# EAGLE design Combine-CPU-POWER-RELAY-smd (EAGLE 7.6.0)
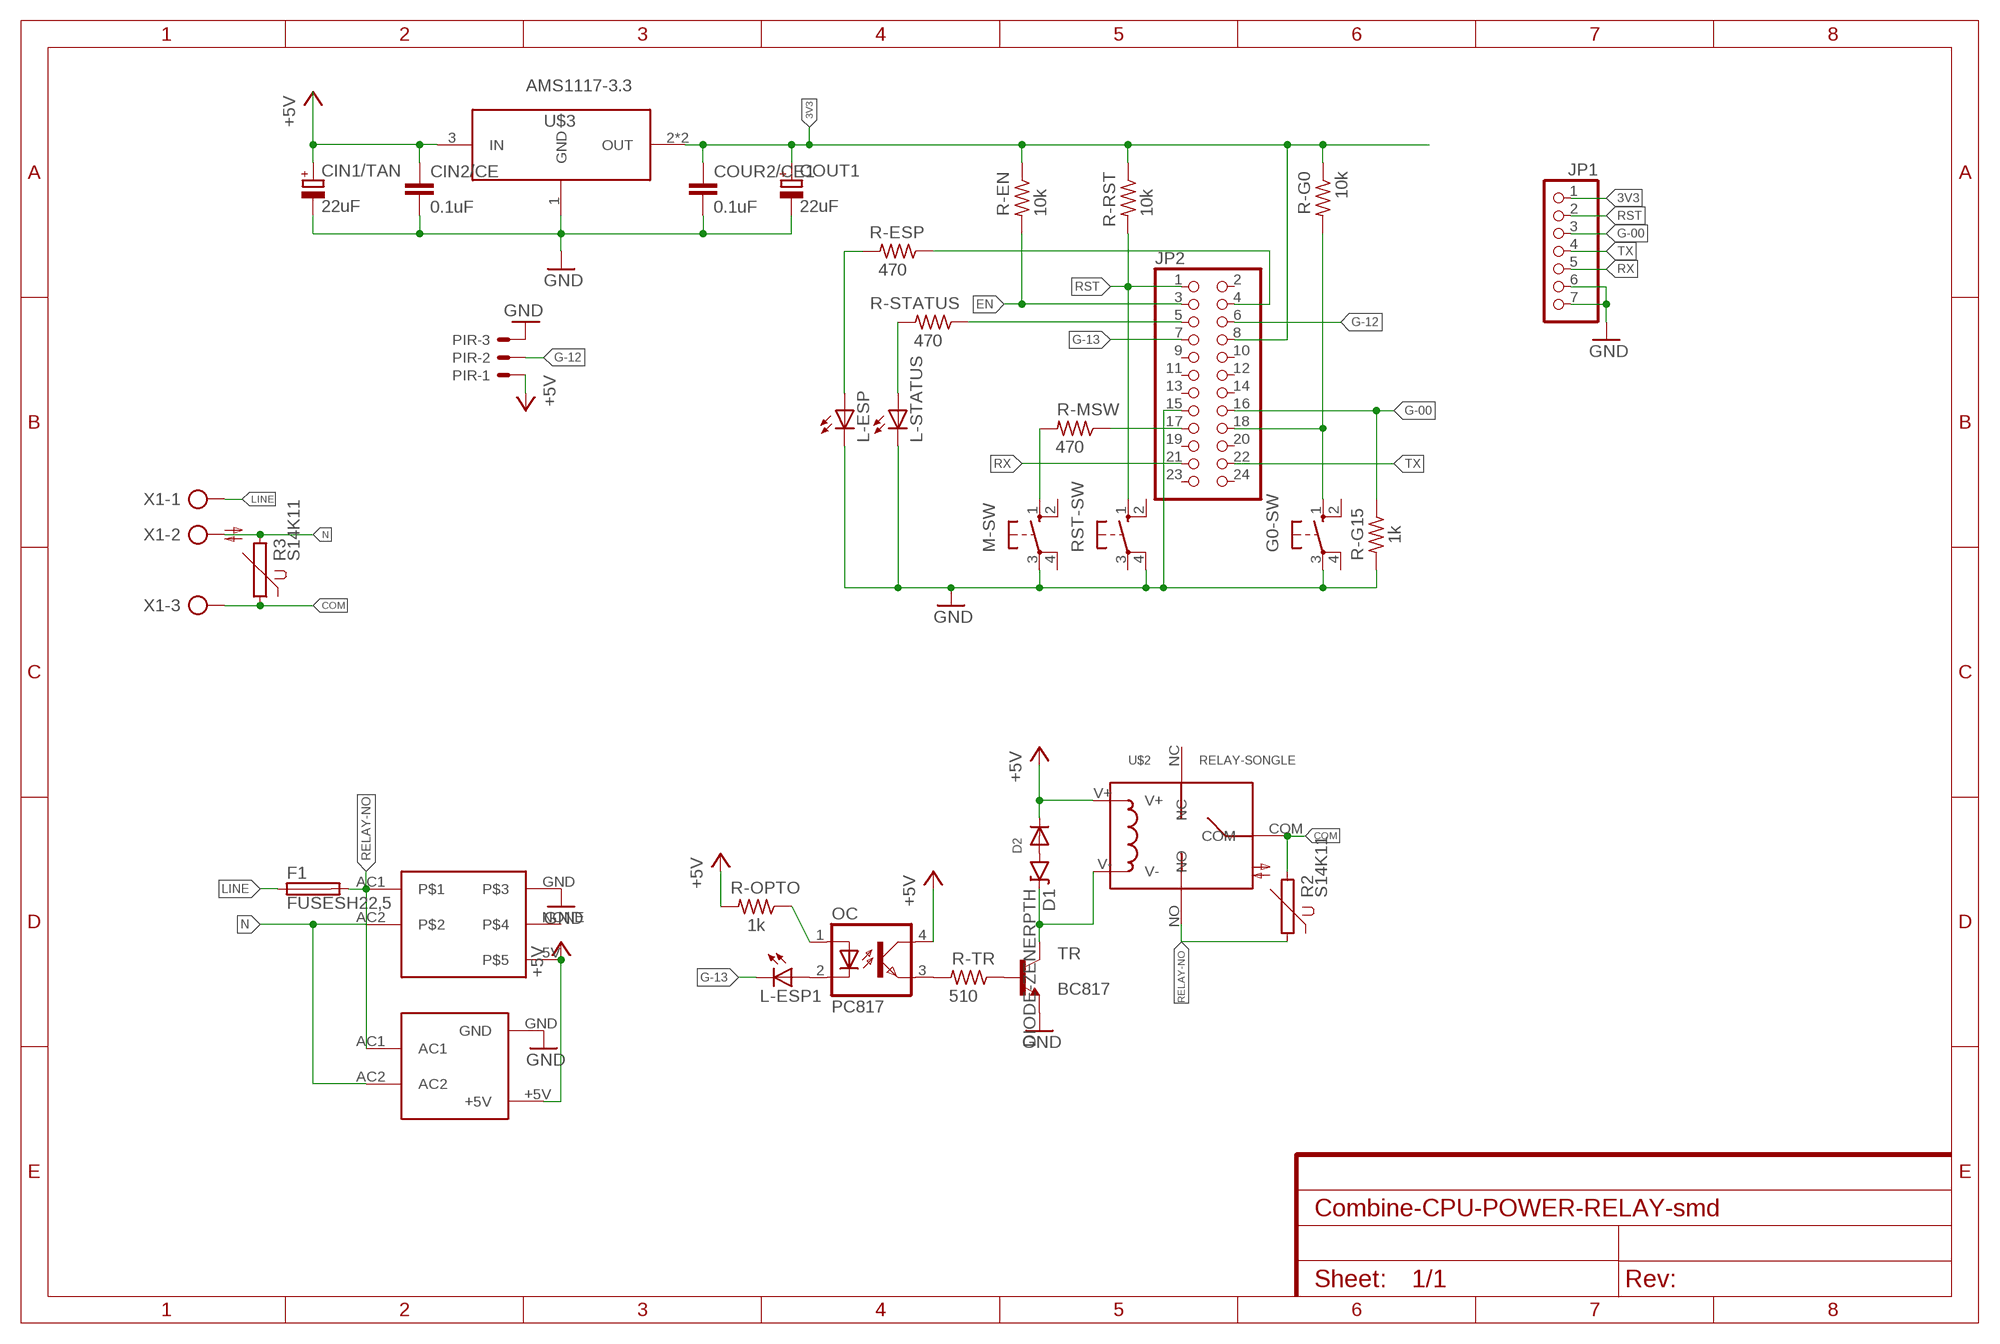
[diagram p0: schematic, sheet 1]

## Parts
CIN1/TAN  22uF  CPOL-EUB/3528-21R  [B/3528-21R]
CIN2/CE  0.1uF  C-EUC0805  [C0805]
COUR2/CE1  0.1uF  C-EUC0805  [C0805]
COUT1  22uF  CPOL-EUB/3528-21R  [B/3528-21R]
D1  DIODE-ZENERPTH  [DIODE-ZENER]
D2  DIODESMA  [SMADIODE]
F1  FUSESH22,5  [SH22,5]
G0-SW  10-XX  [B3F-10XX]
JP1  PINHD-1X7  [1X07]
JP2  PINHD-2X12  [2X12]
L-ESP  LED3MM  [LED3MM]
L-ESP1  LED3MM  [LED3MM]
L-STATUS  LED3MM  [LED3MM]
M-SW  10-XX  [B3F-10XX]
OC  PC817  [DIL04]
PIR  53048-03  [53048-03]
R2  S14K11  [S14K11]
R3  S14K11  [S14K11]
R-EN  10k  R-US_M0805  [M0805]
R-ESP  470  R-US_M0805  [M0805]
R-G0  10k  R-US_M0805  [M0805]
R-G15  1k  R-US_M0805  [M0805]
R-MSW  470  R-US_M0805  [M0805]
R-OPTO  1k  R-US_M0805  [M0805]
R-RST  10k  R-US_M0805  [M0805]
R-STATUS  470  R-US_M0805  [M0805]
R-TR  510  R-US_M0805  [M0805]
RST-SW  10-XX  [B3F-10XX]
TR  BC817  BC817-16SMD  [SOT23-BEC]
U$1  HLK-PM01  [HLK-PM01]
U$2  RELAY-SONGLE  [RELAY-SONGLE]
U$3  AMS1117-3.3  [SOT-223]
U$4  POWERSUPPLY-5V-700MA  [POWERSUPPLY-5V-700MA]
X1  AK300/3  [AK300/3]

## Nets
3V3: COUR2/CE1.1 COUT1.+ JP1.1 JP2.8 R-EN.1 R-G0.1 R-RST.1 U$3.2(OUT) U$3.4(OUT)
+5V: CIN1/TAN.+ CIN2/CE.1 D2.C OC.4(COL) PIR.1 R-OPTO.2 U$1.+5V U$2.V+ U$3.3(IN) U$4.5V
COM: R2.2 R3.1 U$2.COM X1.3
EN: JP2.3 R-EN.2
G-00: JP1.3 JP2.16 R-G15.1
G-12: JP2.6 PIR.2
G-13: JP2.7 L-ESP1.K(C)
GND: CIN1/TAN.- CIN2/CE.2 COUR2/CE1.2 COUT1.- G0-SW.3(P) JP1.6 JP1.7 JP2.15 L-ESP.K(C) L-STATUS.K(C) M-SW.3(P) PIR.3 R-G15.2 RST-SW.4(P1) TR.E U$1.GND U$3.1(GND) U$4.GND
LINE: F1.1 X1.1
N: R3.2 U$1.AC2 U$4.AC2 X1.2
N$1: OC.3(EMIT) R-TR.2
N$2: R-TR.1 TR.B
N$7: JP2.17 R-MSW.1
N$8: JP2.5 R-STATUS.1
N$13: OC.1(A) R-OPTO.1
N$16: D1.P$2(A) D2.A
N$17: D1.P$1(C) TR.C U$2.V-
N$19: JP2.4 R-ESP.1
N$23: L-ESP1.A OC.2(C)
N$24: M-SW.1(S) R-MSW.2
N$25: L-STATUS.A R-STATUS.2
N$26: L-ESP.A R-ESP.2
N$27: G0-SW.1(S) JP2.18 R-G0.2
RELAY-NO: F1.2 R2.1 U$1.AC1 U$2.NO U$4.AC1
RST: JP1.2 JP2.1 R-RST.2 RST-SW.1(S)
RX: JP1.5 JP2.21
TX: JP1.4 JP2.22
Unconnected: G0-SW.2(S1) G0-SW.4(P1) JP2.2 JP2.9 JP2.10 JP2.11 JP2.12 JP2.13 JP2.14 JP2.19 JP2.20 JP2.23 JP2.24 M-SW.2(S1) M-SW.4(P1) RST-SW.2(S1) RST-SW.3(P) U$2.NC U$4.NONE

## Library data of the parts
CIN1/TAN COUT1 = rcl:CPOL-EU: POLARIZED CAPACITOR, European symbol
CIN2/CE COUR2/CE1 = rcl:C-EU: CAPACITOR, European symbol
D1 = SparkFun-DiscreteSemi:DIODE-ZENER: Zener Diode Production Part - 8199 3.4V Zener Voltage
D2 = adafruit:DIODE: Diode SMADIODE - SMA Surface Mount Package 20V 1A Schottky Diode Digikey: 641-1014-6-ND DO-1N4148 - Through Hole Small Current Diode SOD-123 20V 1 A (.5mV Vf) Schottky Diode - Digikey: MBRX120TPMSCT-ND SOD-323 10V 570mA (.38mV Vf, 3ns) Schottky Diode - Digikey: ZLLS410CT-ND SOD-523 30V 30mA Schottky Diode (RB751S-40TE61) - Digikey: RB751S-40TE61CT-ND SOT23-R/W - SOT23 Package (R = Solder Paste/Reflow Ovens, W = Hand-Soldering) BAT54Film 40V 300mA - Digikey: 497-7162-1-ND
F1 = fuse:FUSE: Fuse; OC_FARNELL: unknown; OC_NEWARK: unknown
G0-SW M-SW RST-SW = switch-omron:10-XX: OMRON SWITCH; MPN: B3F-1000; OC_FARNELL: 176432; OC_NEWARK: 36M3542
JP1 = pinhead:PINHD-1X7: PIN HEADER
JP2 = pinhead:PINHD-2X12: PIN HEADER
L-ESP L-ESP1 L-STATUS = led:LED: LED OSRAM: - CHIPLED LG R971, LG N971, LY N971, LG Q971, LY Q971, LO R971, LY R971 LH N974, LH R974 LS Q976, LO Q976, LY Q976 LO Q996 - Hyper CHIPLED LW Q18S LB Q993, LB Q99A, LB R99A - SideLED LS A670, LO A670, LY A670, LG A670, LP A670 LB A673, LV A673, LT A673, LW A673 LH A674 LY A675 LS A676, LA A676, LO A676, LY A676, LW A676 LS A679, LY A679, LG A679 - Hyper Micro SIDELED® LS Y876, LA Y876, LO Y876, LY Y876 LT Y87S - SmartLED LW L88C, LW L88S LB L89C, LB L89S, LG L890 LS L89K, LO L89K, LY L89K LS L896, LA L896, LO L896, LY L896 - TOPLED LS T670, LO T670, LY T670, LG T670, LP T670 LSG T670, LSP T670, LSY T670, LOP T670, LYG T670 LG T671, LOG T671, LSG T671 LB T673, LV T673, LT T673, LW T673 LH T674 LS T676, LA T676, LO T676, LY T676, LB T676, LH T676, LSB T676, LW T676 LB T67C, LV T67C, LT T67C, LS T67K, LO T67K, LY T67K, LW E67C LS E67B, LA E67B, LO E67B, LY E67B, LB E67C, LV E67C, LT E67C LW T67C LS T679, LY T679, LG T679 LS T770, LO T770, LY T770, LG T770, LP T770 LB T773, LV T773, LT T773, LW T773 LH T774 LS E675, LA E675, LY E675, LS T675 LS T776, LA T776, LO T776, LY T776, LB T776 LHGB T686 LT T68C, LB T68C - Hyper Mini TOPLED® LB M676 - Mini TOPLED Santana® LG M470 LS M47K, LO M47K, LY M47K Source: http://www.osram.convergy.de LUXEON: - LUMILED® LXK2-PW12-R00, LXK2-PW12-S00, LXK2-PW14-U00, LXK2-PW14-V00 LXK2-PM12-R00, LXK2-PM12-S00, LXK2-PM14-U00 LXK2-PE12-Q00, LXK2-PE12-R00, LXK2-PE12-S00, LXK2-PE14-T00, LXK2-PE14-U00 LXK2-PB12-K00, LXK2-PB12-L00, LXK2-PB12-M00, LXK2-PB14-N00, LXK2-PB14-P00, LXK2-PB14-Q00 LXK2-PR12-L00, LXK2-PR12-M00, LXK2-PR14-Q00, LXK2-PR14-R00 LXK2-PD12-Q00, LXK2-PD12-R00, LXK2-PD12-S00 LXK2-PH12-R00, LXK2-PH12-S00 LXK2-PL12-P00, LXK2-PL12-Q00, LXK2-PL12-R00 Source: www.luxeon.com KINGBRIGHT: KA-3528ASYC Source: www.kingbright.com
OC = optocoupler:PC817: SHARP OPTO COUPLER; MPN: PC817X4J000F; OC_FARNELL: 9707727; OC_NEWARK: 97K7059
PIR = con-molex:53?-03: CONNECTOR wire to board 1.25 mm (.049 inch) pitch header; MF: WALDOM/MOLEX; MPN: 53048-0310; OC_FARNELL: 9732918; OC_NEWARK: 38C9908
R2 R3 = varistor:S14K11: VARISTOR
R-EN R-ESP R-G0 R-G15 R-MSW R-OPTO R-RST R-STATUS R-TR = rcl:R-US_: RESISTOR, American symbol
TR = transistor-npn:BC817*: NPN Transistor
U$1 = HLK-PM01:HLK-PM01
U$2 = Seeed-OPL-Relay:RELAY-SONGLE
U$3 = AMS1117-3.3:AMS1117-3.3: 1A LOW DROPOUT VOLTAGE REGULATOR
U$4 = PowerSupply-5V-700mA:POWERSUPPLY-5V-700MA
X1 = con-ptr500:AK300/3: CONNECTOR; OC_FARNELL: unknown; OC_NEWARK: unknown

## Net classes
0 default: width 0.305 mm

## Board
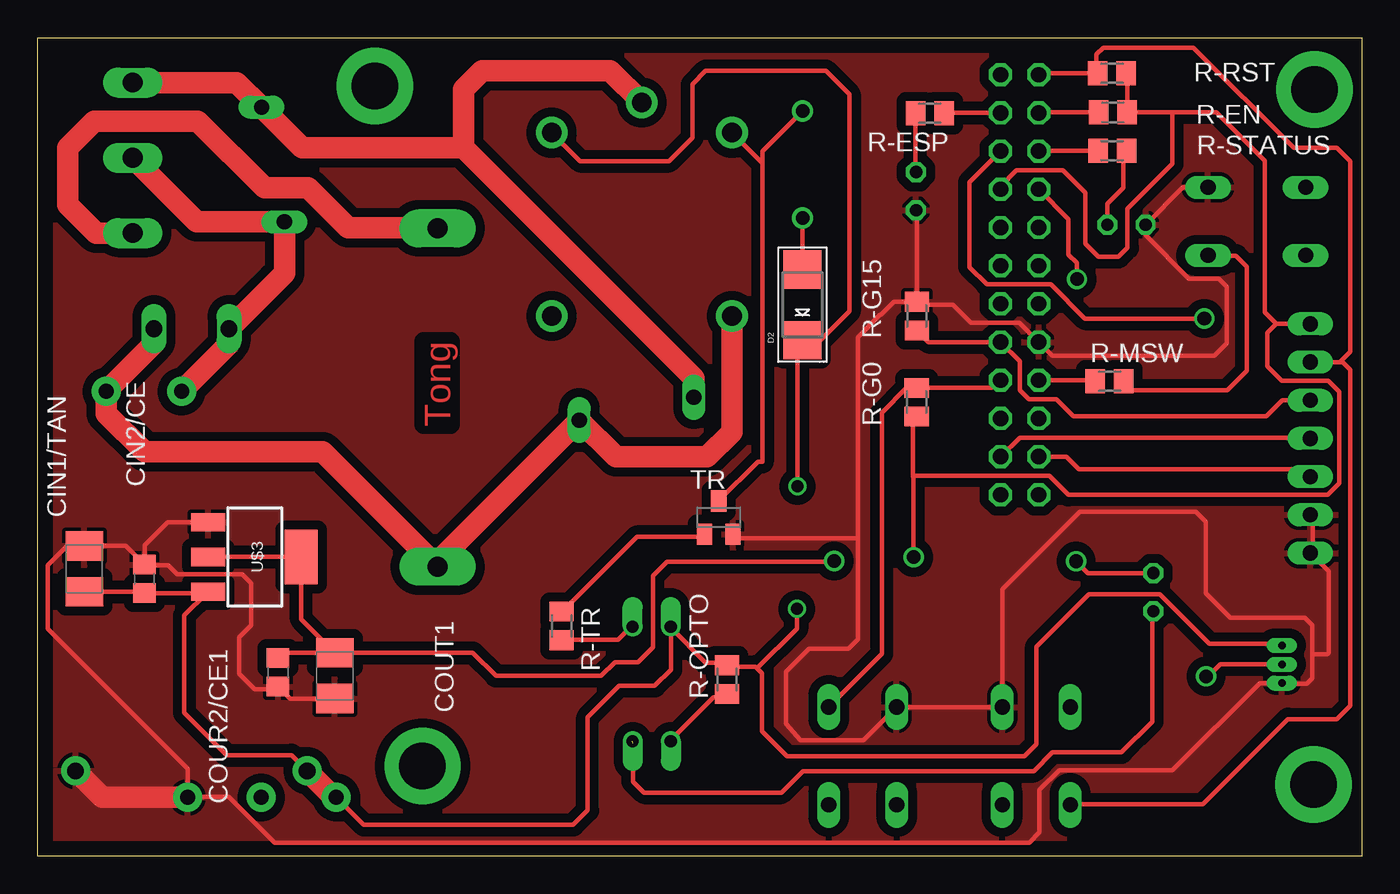
[diagram p1: board, top side]
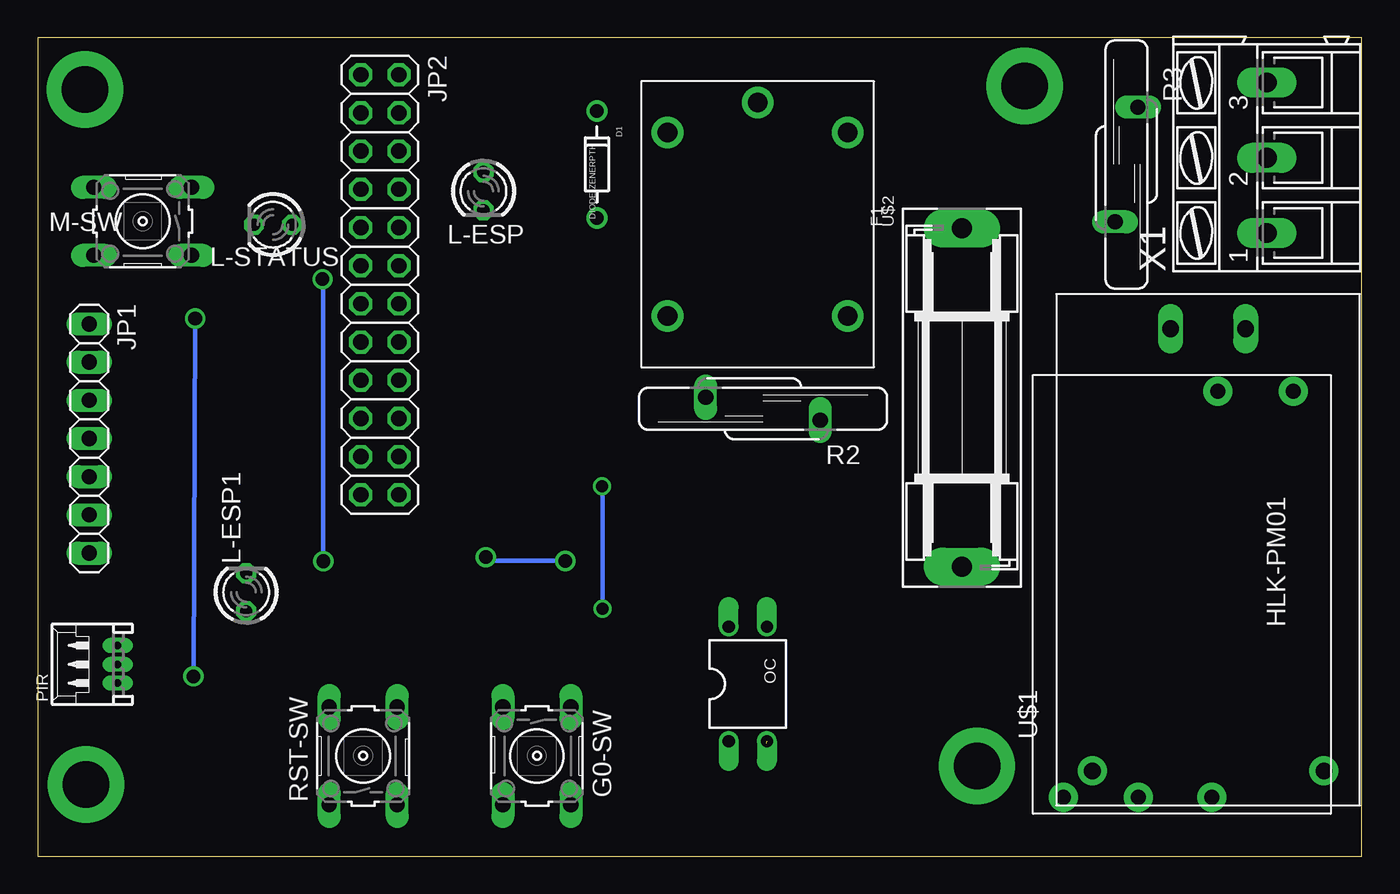
[diagram p2: board, bottom side, seen from below]

Size 88.12 x 54.44 mm. Coordinates in mm from the lower left corner, seen from the top.
Outline: 0,0 0,54.44 88.11,54.44 88.11,0 0,0
Copper layers (1*16): Top 0.035mm / dielectric 1.5mm / Bottom 0.035mm
Design rules "default": minimum track width 10mil, minimum drill 24mil, track to track 8mil, track to pad 8mil, pad to pad 8mil, via to via 8mil, smd to smd 8mil, copper to edge 40mil, drill to drill 8mil, minimum pad ring 10mil, minimum via ring 8mil, stop-mask expansion 4mil, vias tented up to drill 0mil, thermal gap 10mil

### Footprints (pad centres in the part's own frame; a part is rotated, then mirrored left to right if it is on the bottom)
B/3528-21R = smd 1.95 x 2.5: + 1.525,0; - -1.525,0
C0805 = smd 1.3 x 1.5: 1 -0.95,0; 2 0.95,0
DIODE-ZENER = drill 0.9: P$1 -3.556,0; P$2 3.556,0
SMADIODE = smd 2.54 x 2.54: A 2.349,0; C -2.349,0
SH22,5 = drill 1.321 pad 2.54 long: 1 -11.252,0; 2 11.252,0
B3F-10XX = drill 1.016 long: 1 -3.251,2.261; 2 3.251,2.261; 3 -3.251,-2.261; 4 3.251,-2.261
1X07 = drill 1.016 long: 1 -7.62,0; 2 -5.08,0; 3 -2.54,0; 4 0,0; 5 2.54,0; 6 5.08,0; 7 7.62,0
2X12 = drill 1.016 octagon: 1 -13.97,-1.27; 2 -13.97,1.27; 3 -11.43,-1.27; 4 -11.43,1.27; 5 -8.89,-1.27; 6 -8.89,1.27; 7 -6.35,-1.27; 8 -6.35,1.27; 9 -3.81,-1.27; 10 -3.81,1.27; 11 -1.27,-1.27; 12 -1.27,1.27; 13 1.27,-1.27; 14 1.27,1.27; 15 3.81,-1.27; 16 3.81,1.27; 17 6.35,-1.27; 18 6.35,1.27; 19 8.89,-1.27; 20 8.89,1.27; 21 11.43,-1.27; 22 11.43,1.27; 23 13.97,-1.27; 24 13.97,1.27
LED3MM = drill 0.813 octagon: A -1.27,0; K 1.27,0
DIL04 = drill 0.813 offset: 1 -1.27,-3.81; 2 1.27,-3.81; 3 1.27,3.81; 4 -1.27,3.81
53048-03 = drill 0.5 pad 0.698 long: 1 1.25,-1.25; 2 0,-1.25; 3 -1.25,-1.25
S14K11 = drill 1.016 long: 1 -0.762,-3.81; 2 0.762,3.81
M0805 = smd 1.3 x 1.6: 1 -0.95,0; 2 0.95,0
SOT23-BEC = smd 1 x 1.4: B -0.95,-1.1; C 0,1.1; E 0.95,-1.1
HLK-PM01 = drill 1.1 pad 1.93: +5V 15.19,-7.76; GND 15.19,7.64 | drill 1.1 long: AC1 -14.21,2.44; AC2 -14.21,-2.56
RELAY-SONGLE = drill 1.3 pad 2.1: COM -8.1,0; NC 6.1,6; NO 6.1,-6; V+ -6.1,6; V- -6.1,-6
SOT-223 = smd 1.219 x 2.235: 1 -2.381,-3.099; 2 -0.07,-3.099; 3 2.241,-3.099 | smd 3.6 x 2.2: 4 -0.07,3.099
POWERSUPPLY-5V-700MA = drill 1 pad 1.93: 5V 13.5,-7.9; AC1 -13.5,7.4; AC2 -13.5,2.4; GND 13.5,2; NONE 13.5,-2.9
AK300/3 = drill 1.321 long: 1 -5.004,0; 2 0,0; 3 5.004,0

### Placement (x,y rotation side)
CIN1/TAN  3.11,19.11 270 top
CIN2/CE  7.11,18.45 90 top
COUR2/CE1  16,12.22 270 top
COUT1  19.78,12 90 top
D1  50.9,46.01 270 bottom
D2  50.9,36.67 90 top
F1  26.61,30.5 270 bottom
G0-SW  54.9,6.67 270 bottom
JP1  84.68,27.78 270 bottom
JP2  65.34,38 270 bottom
L-ESP  58.45,44.23 270 bottom
L-ESP1  74.23,17.56 90 bottom
L-STATUS  72.45,42.01 180 bottom
M-SW  81.12,42.23 180 bottom
OC  40.86,11.45 0 bottom
PIR  84.04,12.76 90 bottom
R2  39.85,29.76 90 bottom
R3  15.66,46 180 bottom
R-EN  71.54,49.46 180 top
R-ESP  59.36,49.42 180 top
R-G0  58.49,30.2 90 top
R-G15  58.5,35.93 90 top
R-MSW  71.32,31.58 0 top
R-OPTO  45.88,11.75 90 top
R-RST  71.48,52.07 180 top
R-STATUS  71.5,46.91 0 top
R-TR  34.88,15.31 270 top
RST-SW  66.45,6.67 90 bottom
TR  45.32,22.52 0 top
U$1  10.17,20.87 270 bottom
U$2  40.2,42.03 270 bottom
U$3  14.45,19.83 270 top
U$4  11.98,17.41 270 bottom
X1  6.33,46.45 90 bottom

### Tracks (layer width: path | path; a pad name or v marks a point on that pad's centre or on a via)
3V3  (via drill 0.9)
  Top 0.305: COUR2/CE1.1 16.36,13.53 COUT1.+ | COUT1.+ 17.55,15.76 U$3.4 U$3.2 | R-RST.1 72.49,52.01 R-EN.1 75.46,49.46 | 82.41,35.4 81.82,34.81 81.82,32.58 82.77,31.63 85.87,31.63 86.61,30.89 86.61,24.8 85.85,24.03 68.58,24.03 67.31,25.3 58.32,25.3 58.25,25.23 | 82.41,35.4 JP1.1 | R-G0.1 58.25,29.01 58.25,25.23 | 75.46,49.46 78.43,49.46 81.64,46.25 81.64,36.17 82.41,35.41 82.41,35.4 | JP2.8 64.07,44.54 65.14,45.6 68.21,45.6 69.7,44.11 69.7,40.74 70.58,39.86 71.91,39.86 72.51,40.46 72.51,43.05 75.5,46.04 75.5,49.42 75.46,49.46 | COUT1.+ 28.96,13.53 30.5,11.98 37.5,11.98 38.42,12.9 39.95,12.9 40.94,13.89 40.94,18.64 41.89,19.59 52.96,19.59 v53,19.63 | v58.29,19.88 58.29,25.19 58.25,25.23
  Bottom 0.305: v53,19.63 58.04,19.63 v58.29,19.88
+5V  (via drill 0.8)
  Top 0.305: CIN1/TAN.+ 7.02,17.59 CIN2/CE.1 11.26,17.5 | 11.26,17.5 U$3.3 | U$2.V+ 36.1,46.23 42.01,46.23 43.56,47.78 43.56,51.34 44.45,52.23 52.45,52.23 54.01,50.67 54.01,36.23 52.1,34.32 D2.C 50.56,34.32 v50.56,24.59 | PIR.1 82.55,14.13 77.98,14.13 74.68,17.43 69.96,17.43 66.46,13.93 66.46,7.45 65.66,6.65 49.86,6.65 48.2,8.31 48.2,12.16 47.88,12.48 | U$4.5V 21.7,2.08 35.64,2.08 36.6,3.04 36.6,9.23 38.69,11.32 41.06,11.32 42.13,12.39 OC.4 42.16,15.14 44.45,12.86 45.72,12.86 R-OPTO.2 45.97,12.86 46.22,12.61 47.75,12.61 47.88,12.48 | 11.26,17.5 9.77,16.01 9.77,9.53 12.59,6.71 16.9,6.71 U$1.+5V | v50.52,16.45 50.52,15.12 47.88,12.48
  Top 1.422: U$1.+5V 19.7,3.91 U$4.5V
  Bottom 0.305: v50.56,24.59 50.52,24.59 v50.52,16.45
COM
  Top 1.422: X1.3 13.26,51.45 R3.1 17.59,47.12 28.33,47.12 | R2.2 43.66,31.79 28.33,47.12 | U$2.COM 38.08,52.25 29.58,52.25 28.33,51 28.33,47.12
EN
  Top 0.305: JP2.3 66.64,49.46 R-EN.2
G-00
  Top 0.305: R-G15.1 59.28,34.19 JP2.16 65.36,32.91 65.36,30.97 65.94,30.39 67.77,30.39 68.92,29.24 81.75,29.24 82.83,30.32 JP1.3
G-12  (via drill 0.9)
  Top 0.305: JP2.6 62.01,44.83 62.01,39.17 63.16,38.02 67.41,38.02 69.69,35.74 v77.63,35.75 | PIR.2 78.71,12.76 77.91,11.96 v77.74,11.96
  Bottom 0.305: v77.63,35.75 v77.74,11.96
G-13  (via drill 0.9)
  Top 0.305: JP2.7 68.6,42.37 68.6,40.01 69.15,39.46 v69.15,38.37 | v69.1,19.61 69.89,18.83 L-ESP1.K
  Bottom 0.305: v69.15,38.37 69.1,38.32 v69.1,19.61
GND
  Top 0.305: CIN2/CE.2 5.87,20.64 CIN1/TAN.- 3.08,20.67 2,20.67 0.67,19.34 0.67,15.11 9.98,5.8 U$4.GND 10.67,3.97 12.7,3.97 15.76,0.9 65.98,0.9 66.67,1.59 66.67,4.41 67.97,5.71 75.51,5.71 81.31,11.51 PIR.3 82.83,11.47 84.46,11.47 84.81,11.82 84.81,13.41 | CIN2/CE.2 7.11,20.67 8.67,22.22 11.33,22.22 U$3.1 | COUT1.- 16.8,10.48 COUR2/CE1.2 15.84,11.11 14.43,11.11 13.4,12.14 13.4,14.54 14.2,15.34 14.2,18.14 13.6,18.74 9.3,18.74 8.7,19.34 7.16,19.34 CIN2/CE.2 | L-ESP.K 58.5,42.91 R-G15.2 | M-SW.3 76.21,44.49 L-STATUS.K 73.72,41.29 76.6,38.41 78.59,38.41 79.13,37.87 79.13,34.11 78.3,33.28 67.52,33.28 JP2.15 65.33,35.46 62.1,35.46 60.9,36.67 58.7,36.67 R-G15.2 | JP1.6 84.84,22.51 84.84,20.22 JP1.7 85.9,18.94 85.9,13.51 85.8,13.41 84.81,13.41 | 58.42,36.99 R-G15.2 | 84.81,13.41 84.81,15.34 84.31,15.84 79.36,15.84 77.72,17.48 77.72,22.24 77.07,22.89 69.34,22.89 64.19,17.75 RST-SW.4 G0-SW.3 54.94,7.7 50.76,7.7 49.78,8.8 49.78,12.26 51.32,13.8 53.94,13.8 54.57,14.43 54.57,21.15 | R-G15.2 56.99,36.88 56.11,35.99 56.06,35.99 54.57,34.5 54.57,21.15 | TR.E 46.54,21.15 54.57,21.15
  Top 1.422: U$1.GND 4.3,3.91 U$4.GND
  pour Top (isolate 0.61): 0,0.04 88,0.04 88,54.44 0,54.44
LINE
  Top 1.422: X1.1 3.89,41.45 2,43.34 2,47.12 3.78,48.89 10.67,48.89 15.11,44.45 18,44.45 20.67,41.78 26.59,41.78 F1.1
N
  Top 1.422: U$4.AC2 12.73,34.07 U$1.AC2 16.43,38.77 R3.2 10.58,42.19 X1.2
N$1
  Top 0.305: R-TR.2 35.05,14.38 38.61,14.38 39.37,15.14 OC.3
N$2
  Top 0.305: R-TR.1 35.05,16.41 39.88,21.24 44.19,21.24 TR.B
N$3  (via drill 3.1 pad 5.08)
  other vias: 25.61,6
N$6  (via drill 3.1 pad 5.08)
  other vias: 84.89,4.78
N$7
  Top 0.305: JP2.17 70.36,31.65 R-MSW.1
N$8
  Top 0.305: JP2.5 66.62,46.91 R-STATUS.1
N$9  (via drill 3.1 pad 5.08)
  other vias: 22.44,51.22
N$13
  Top 0.305: R-OPTO.1 45.72,10.57 44.96,10.57 42.16,7.78 OC.1
N$16
  Top 0.305: D1.P$2 D2.A
N$17
  Top 0.305: U$2.V- 48.23,46.1 | 48.23,46.1 48.23,26.23 47.92,26.23 TR.C | 48.23,46.1 48.23,46.89 D1.P$1
N$18  (via drill 3.1 pad 5.08)
  other vias: 84.95,51
N$19
  Top 0.305: R-ESP.1 60.33,49.43 JP2.4
N$23  (1 unrouted)
  Top 0.305: L-ESP1.A 74.17,16.16 74.17,8.95 72.12,6.9 67.52,6.9 66.28,5.66 50.93,5.66 49.49,4.22 40.35,4.22 39.61,4.96 39.61,7.51 39.62,7.52
N$24
  Top 0.305: R-MSW.2 72.87,30.98 79.16,30.98 80.47,32.29 80.47,39.2 79.73,39.94 77.89,39.94 M-SW.1
N$25
  Top 0.305: R-STATUS.2 72.23,46.68 72.23,44.45 71.18,43.4 L-STATUS.A
N$26
  Top 0.305: L-ESP.A 58.41,45.54 R-ESP.2
N$27
  Top 0.305: JP2.18 64.01,31.65 63.5,31.15 58.67,31.15 R-G0.2 57.82,31.15 56.17,29.49 56.17,13.45 G0-SW.1
RELAY-NO
  Top 1.422: U$1.AC1 7.73,34.07 U$4.AC1 4.58,29.43 7.11,26.89 18.97,26.89 F1.2 26.61,19.57 R2.1 38.48,26.55 44.55,26.55 46.2,28.21 U$2.NO
RST
  Top 0.305: JP2.1 66.71,52.07 R-RST.2 70.45,52.15 70.45,53.34 70.9,53.78 76.9,53.78 83.57,47.12 86.45,47.12 87.34,46.23 87.34,33.56 86.65,32.86 | 86.65,32.86 JP1.2 | RST-SW.1 68.75,3.45 77.53,3.45 83.19,9.11 86.45,9.11 87.34,10 87.34,32.35 86.83,32.86 86.65,32.86
RX
  Top 0.305: JP2.21 68.44,26.57 69.29,25.72 84.19,25.72 JP1.5
TX
  Top 0.305: JP1.4 84.58,27.84 65.34,27.84 JP2.22

### Text on the board
Top: Tong